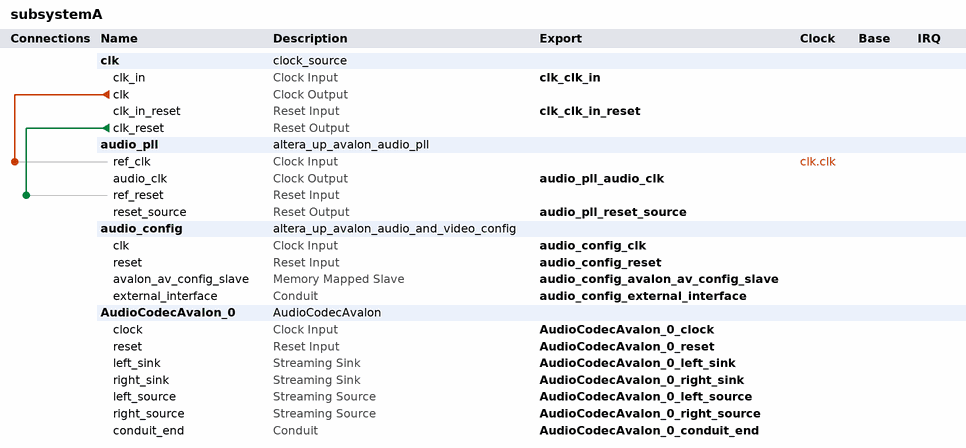
[diagram p0: system contents]
# Platform Designer (Qsys) system subsystemA, Cyclone V 5CSEMA5F31C6
# Parameters at their usual value, and those the tool derives, are not listed.
package require -exact qsys 16.1
create_system subsystemA
set_project_property DEVICE_FAMILY {Cyclone V}
set_project_property DEVICE 5CSEMA5F31C6

add_instance clk clock_source 16.1
set_instance_parameter_value clk clockFrequency 50000000

add_instance audio_pll altera_up_avalon_audio_pll 16.1
set_instance_parameter_value audio_pll gui_refclk 50.0

add_instance audio_config altera_up_avalon_audio_and_video_config 16.1
set_instance_parameter_value audio_config audio_in {Line In to ADC}
set_instance_parameter_value audio_config bit_length 24
set_instance_parameter_value audio_config board DE1-SoC
set_instance_parameter_value audio_config line_in_bypass false
set_instance_parameter_value audio_config sampling_rate {48 kHz}

add_instance AudioCodecAvalon_0 AudioCodecAvalon 1.0
set_instance_parameter_value AudioCodecAvalon_0 gDataWidth 24
set_instance_parameter_value AudioCodecAvalon_0 gDataWidthLen 5

# connections
add_connection clk.clk audio_pll.ref_clk clock
add_connection clk.clk_reset audio_pll.ref_reset reset

# exported interfaces
add_interface AudioCodecAvalon_0_clock clock sink
set_interface_property AudioCodecAvalon_0_clock EXPORT_OF AudioCodecAvalon_0.clock
add_interface AudioCodecAvalon_0_conduit_end conduit end
set_interface_property AudioCodecAvalon_0_conduit_end EXPORT_OF AudioCodecAvalon_0.conduit_end
add_interface AudioCodecAvalon_0_left_sink avalon_streaming sink
set_interface_property AudioCodecAvalon_0_left_sink EXPORT_OF AudioCodecAvalon_0.left_sink
add_interface AudioCodecAvalon_0_left_source avalon_streaming source
set_interface_property AudioCodecAvalon_0_left_source EXPORT_OF AudioCodecAvalon_0.left_source
add_interface AudioCodecAvalon_0_reset reset sink
set_interface_property AudioCodecAvalon_0_reset EXPORT_OF AudioCodecAvalon_0.reset
add_interface AudioCodecAvalon_0_right_sink avalon_streaming sink
set_interface_property AudioCodecAvalon_0_right_sink EXPORT_OF AudioCodecAvalon_0.right_sink
add_interface AudioCodecAvalon_0_right_source avalon_streaming source
set_interface_property AudioCodecAvalon_0_right_source EXPORT_OF AudioCodecAvalon_0.right_source
add_interface audio_config_avalon_av_config_slave avalon slave
set_interface_property audio_config_avalon_av_config_slave EXPORT_OF audio_config.avalon_av_config_slave
add_interface audio_config_clk clock sink
set_interface_property audio_config_clk EXPORT_OF audio_config.clk
add_interface audio_config_external_interface conduit end
set_interface_property audio_config_external_interface EXPORT_OF audio_config.external_interface
add_interface audio_config_reset reset sink
set_interface_property audio_config_reset EXPORT_OF audio_config.reset
add_interface audio_pll_audio_clk clock source
set_interface_property audio_pll_audio_clk EXPORT_OF audio_pll.audio_clk
add_interface audio_pll_reset_source reset source
set_interface_property audio_pll_reset_source EXPORT_OF audio_pll.reset_source
add_interface clk_clk_in clock sink
set_interface_property clk_clk_in EXPORT_OF clk.clk_in
add_interface clk_clk_in_reset reset sink
set_interface_property clk_clk_in_reset EXPORT_OF clk.clk_in_reset

set_interconnect_requirement {$system} qsys_mm.clockCrossingAdapter HANDSHAKE
set_interconnect_requirement {$system} qsys_mm.enableEccProtection FALSE
set_interconnect_requirement {$system} qsys_mm.insertDefaultSlave FALSE
set_interconnect_requirement {$system} qsys_mm.maxAdditionalLatency 1

save_system subsystemA.qsys
